# EAGLE design QuickPSoC3V2_LongPads_04042012 (EAGLE 6.2)
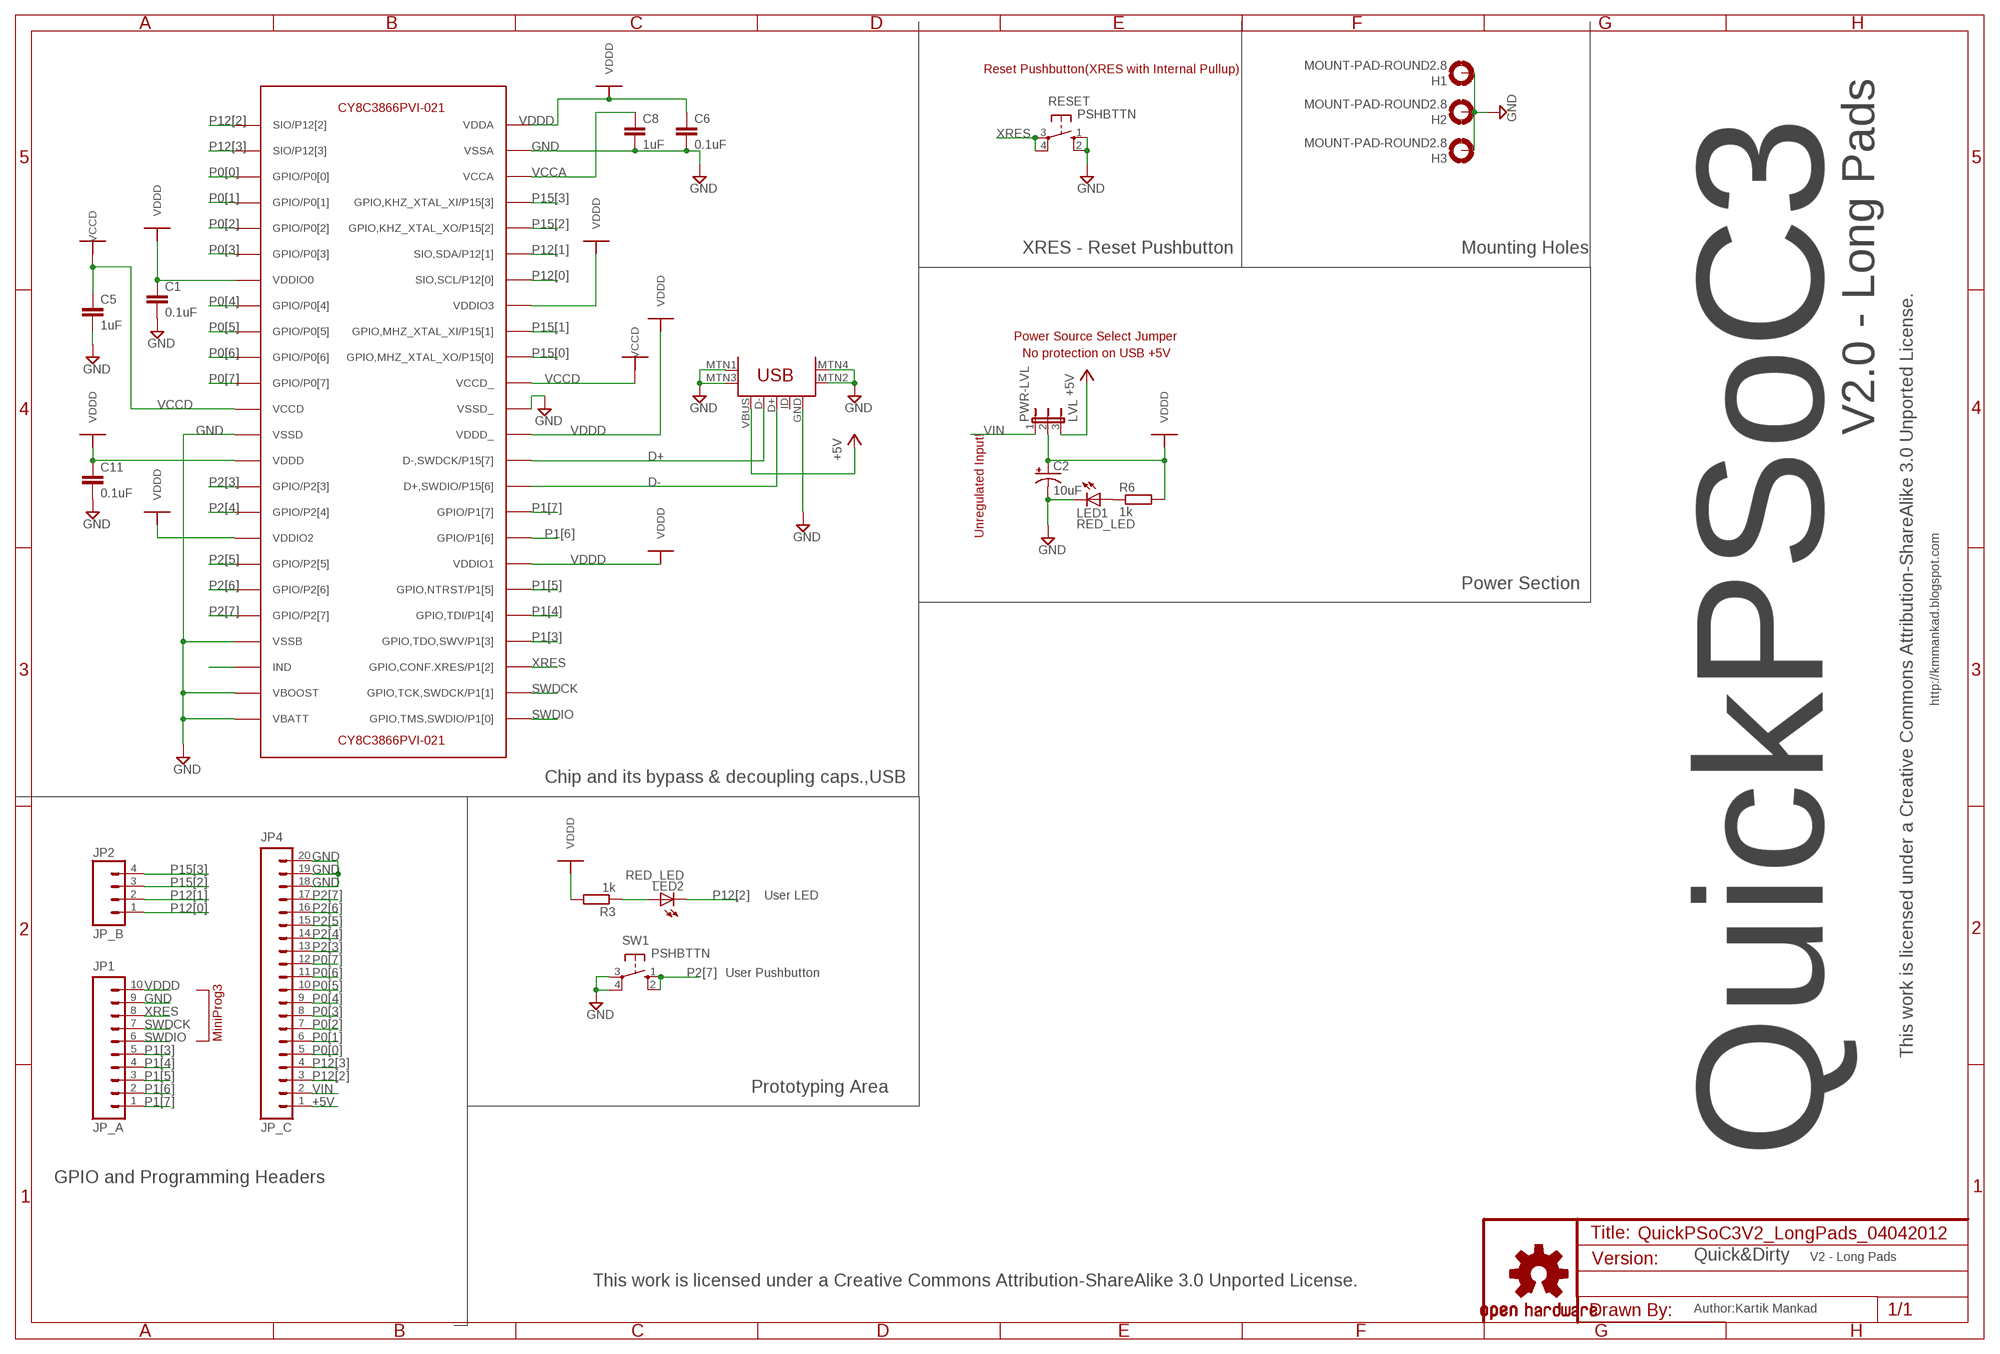
[diagram p0: schematic, sheet 1]

## Parts
C1  0.1uF  C-EUC0805K  [C0805K]
C2  10uF  CAP_POLPTH2  [CPOL-RADIAL-10UF-25V]
C5  1uF  C-EUC0805K  [C0805K]
C6  0.1uF  C-EUC0805K  [C0805K]
C8  1uF  C-EUC0805K  [C0805K]
C11  0.1uF  C-EUC0805K  [C0805K]
H1  MOUNT-PAD-ROUND2.8  [2,8-PAD]
H2  MOUNT-PAD-ROUND2.8  [2,8-PAD]
H3  MOUNT-PAD-ROUND2.8  [2,8-PAD]
JP1  JP_A  M10"  [1X10]
JP2  JP_B  M04PTH  [1X04]
JP4  JP_C  M20  [1X20]
LED1  RED_LED  LED1206  [LED-1206]
LED2  RED_LED  LED1206  [LED-1206]
PWR-LVL  LVL  JP2E  [JP2]
R3  1k  R-EU_M0805  [M0805]
R6  1k  R-EU_M0805  [M0805]
RESET  PSHBTTN  10-XX  [B3F-10XX]
SW1  PSHBTTN  10-XX  [B3F-10XX]
U$1  CY8C3866PVI-021  [SSOP48DL]
U$2  OSHW-LOGOL  [OSHW-LOGO-L]
X1  USB-MINIB-5PIN  [USB-MINIB]

## Nets
+5V: JP4.1 PWR-LVL.3 X1.VBUS
D+: U$1.35(D-,SWDCK/P15[7]) X1.D-
D-: U$1.34(D+,SWDIO/P15[6]) X1.D+
GND: C1.2 C2.2(-) C5.2 C6.2 C8.2 C11.2 H1.B2,8(MOUNT) H2.B2,8(MOUNT) H3.B2,8(MOUNT) JP1.9 JP4.18 JP4.19 JP4.20 LED1.C RESET.1(S) RESET.2(S1) SW1.3(P) SW1.4(P1) U$1.13(VSSD) U$1.21(VSSB) U$1.23(VBOOST) U$1.24(VBATT) U$1.37(VSSD_) U$1.47(VSSA) X1.GND X1.MTN1(MTN2) X1.MTN2(MTN3) X1.MTN3(MTN1) X1.MTN4
N$1: LED1.A R6.1
N$2: LED2.A R3.1
N$22: U$1.22(IND)
P0[0]: JP4.5 U$1.3(GPIO/P0[0])
P0[1]: JP4.6 U$1.4(GPIO/P0[1])
P0[2]: JP4.7 U$1.5(GPIO/P0[2])
P0[3]: JP4.8 U$1.6(GPIO/P0[3])
P0[4]: JP4.9 U$1.8(GPIO/P0[4])
P0[5]: JP4.10 U$1.9(GPIO/P0[5])
P0[6]: JP4.11 U$1.10(GPIO/P0[6])
P0[7]: JP4.12 U$1.11(GPIO/P0[7])
P1[3]: JP1.5 U$1.28(GPIO,TDO,SWV/P1[3])
P1[4]: JP1.4 U$1.29(GPIO,TDI/P1[4])
P1[5]: JP1.3 U$1.30(GPIO,NTRST/P1[5])
P1[6]: JP1.2 U$1.32(GPIO/P1[6])
P1[7]: JP1.1 U$1.33(GPIO/P1[7])
P2[3]: JP4.13 U$1.15(GPIO/P2[3])
P2[4]: JP4.14 U$1.16(GPIO/P2[4])
P2[5]: JP4.15 U$1.18(GPIO/P2[5])
P2[6]: JP4.16 U$1.19(GPIO/P2[6])
P2[7]: JP4.17 SW1.1(S) SW1.2(S1) U$1.20(GPIO/P2[7])
P12[0]: JP2.1 U$1.42(SIO,SCL/P12[0])
P12[1]: JP2.2 U$1.43(SIO,SDA/P12[1])
P12[2]: JP4.3 LED2.C U$1.1(SIO/P12[2])
P12[3]: JP4.4 U$1.2(SIO/P12[3])
P15[0]: U$1.39(GPIO,MHZ_XTAL_XO/P15[0])
P15[1]: U$1.40(GPIO,MHZ_XTAL_XI/P15[1])
P15[2]: JP2.3 U$1.44(GPIO,KHZ_XTAL_XO/P15[2])
P15[3]: JP2.4 U$1.45(GPIO,KHZ_XTAL_XI/P15[3])
SWDCK: JP1.7 U$1.26(GPIO,TCK,SWDCK/P1[1])
SWDIO: JP1.6 U$1.25(GPIO,TMS,SWDIO/P1[0])
VCCA: C8.1 U$1.46(VCCA)
VCCD: C5.1 U$1.12(VCCD) U$1.38(VCCD_)
VDDD: C1.1 C2.1(+) C6.1 C11.1 JP1.10 PWR-LVL.2 R3.2 R6.2 U$1.7(VDDIO0) U$1.14(VDDD) U$1.17(VDDIO2) U$1.31(VDDIO1) U$1.36(VDDD_) U$1.41(VDDIO3) U$1.48(VDDA)
VIN: JP4.2 PWR-LVL.1
XRES: JP1.8 RESET.3(P) RESET.4(P1) U$1.27(GPIO,CONF.XRES/P1[2])
Unconnected: X1.ID

## Notes on the sheet
- Reset Pushbutton(XRES with Internal Pullup)
- XRES - Reset Pushbutton | Mounting Holes
- This work is licensed under a Creative Commons Attribution-ShareAlike 3.0 Unported License.
- Power Source Select Jumper
- No protection on USB +5V
- V2.0 - Long Pads
- Unregulated Input!
- Power Section
- http://kmmankad.blogspot.com
- Chip and its bypass & decoupling caps.,USB
- User LED
- User Pushbutton
- MiniProg3
- Prototyping Area
- QuickPSoC3
- GPIO and Programming Headers
- Quick&Dirty | V2 - Long Pads
- This work is licensed under a Creative Commons Attribution-ShareAlike 3.0 Unported License.
- Author:Kartik Mankad

## Library data of the parts
C1 C5 C6 C8 C11 = rcl:C-EU: CAPACITOR, European symbol
C2 = SparkFun:CAP_POL: Capacitor Polarized These are standard SMD and PTH capacitors. Normally 10uF, 47uF, and 100uF in electrolytic and tantalum varieties. Always verify the external diameter of the through hole cap, it varies with capacity, voltage, and manufacturer. The EIA devices should be standard.
H1-H3 = holes:MOUNT-PAD-ROUND: MOUNTING PAD, round
JP1 = SparkFun:M10: Header 10 Standard 10-pin 0.1" header. Use with straight break away headers (SKU : PRT-00116), right angle break away headers (PRT-00553), swiss pins (PRT-00743), machine pins (PRT-00117), and female headers (PRT-00115).
JP2 = SparkFun:M04: Header 4 Standard 4-pin 0.1" header. Use with straight break away headers (SKU : PRT-00116), right angle break away headers (PRT-00553), swiss pins (PRT-00743), machine pins (PRT-00117), and female headers (PRT-00115). Molex polarized connector foot print use with SKU : PRT-08231 with associated crimp pins and housings. 1MM SMD Version SKU: PRT-10208
JP4 = SparkFun:M20: This is just like the LOCK variant in that the holes are staggared by 5 mil, but except for the last two holes. They are not altered from the "standard" footprint layout. This is used for a special purpose on the layout of our Graphic LCD Backpack. Make sure you want to use this device before selecting it for you project!
LED1 LED2 = SparkFun:LED: LEDs Standard schematic elements and footprints for 5mm, 3mm, 1206, and 0603 sized LEDs. 5mm - Spark Fun Electronics SKU : COM-00529 (and others)
PWR-LVL = jumper:JP2E: JUMPER
R3 R6 = rcl:R-EU_: RESISTOR, European symbol
RESET SW1 = switch-omron:10-XX: OMRON SWITCH
U$1 = cypress_withsoc3:CY8C3866PVI-021: Cypress PSoC® 3 CY8C3666PVI-021 Introducing the CY8C38 family of ultra low-power, flash Programmable System-on-Chip (PSoC®) devices, part of a scalable 8-bit PSoC 3 and 32-bit PSoC 5 platform. The CY8C38 family provides configurable blocks of analog, digital, and interconnect circuitry around a CPU subsystem. The combination of a CPU with a flexible analog subsystem, digital subsystem, routing, and I/O enables a high level of integration in a wide variety of consumer, industrial, and medical applications. Custom Part,added by Kartik Mankad 21-Sept '11 This work is licensed under a Creative Commons Attribution-ShareAlike 3.0 Unported License.
U$2 = SparkFun:OSHW-LOGO: Open Source Hardware Logo This logo indicates the piece of hardware it is found on incorporates a OSHW license and/or adheres to the definition of open source hardware found here: http://freedomdefined.org/OSHW
X1 = SparkFun:USB-MINIB: Mini-USB "B" connector with 5th pin broken out. Created new symbol breaking out 5th "ID" pin in mini/micro USB connector spec. See: http://en.wikipedia.org/wiki/Mini_usb#Cables. Uses same footprint as 4-pin symbol. Also added pins to connect to mounting / shield pads if required (probably not generally needed as signals aren't shielded once they leave the connector).

## Board
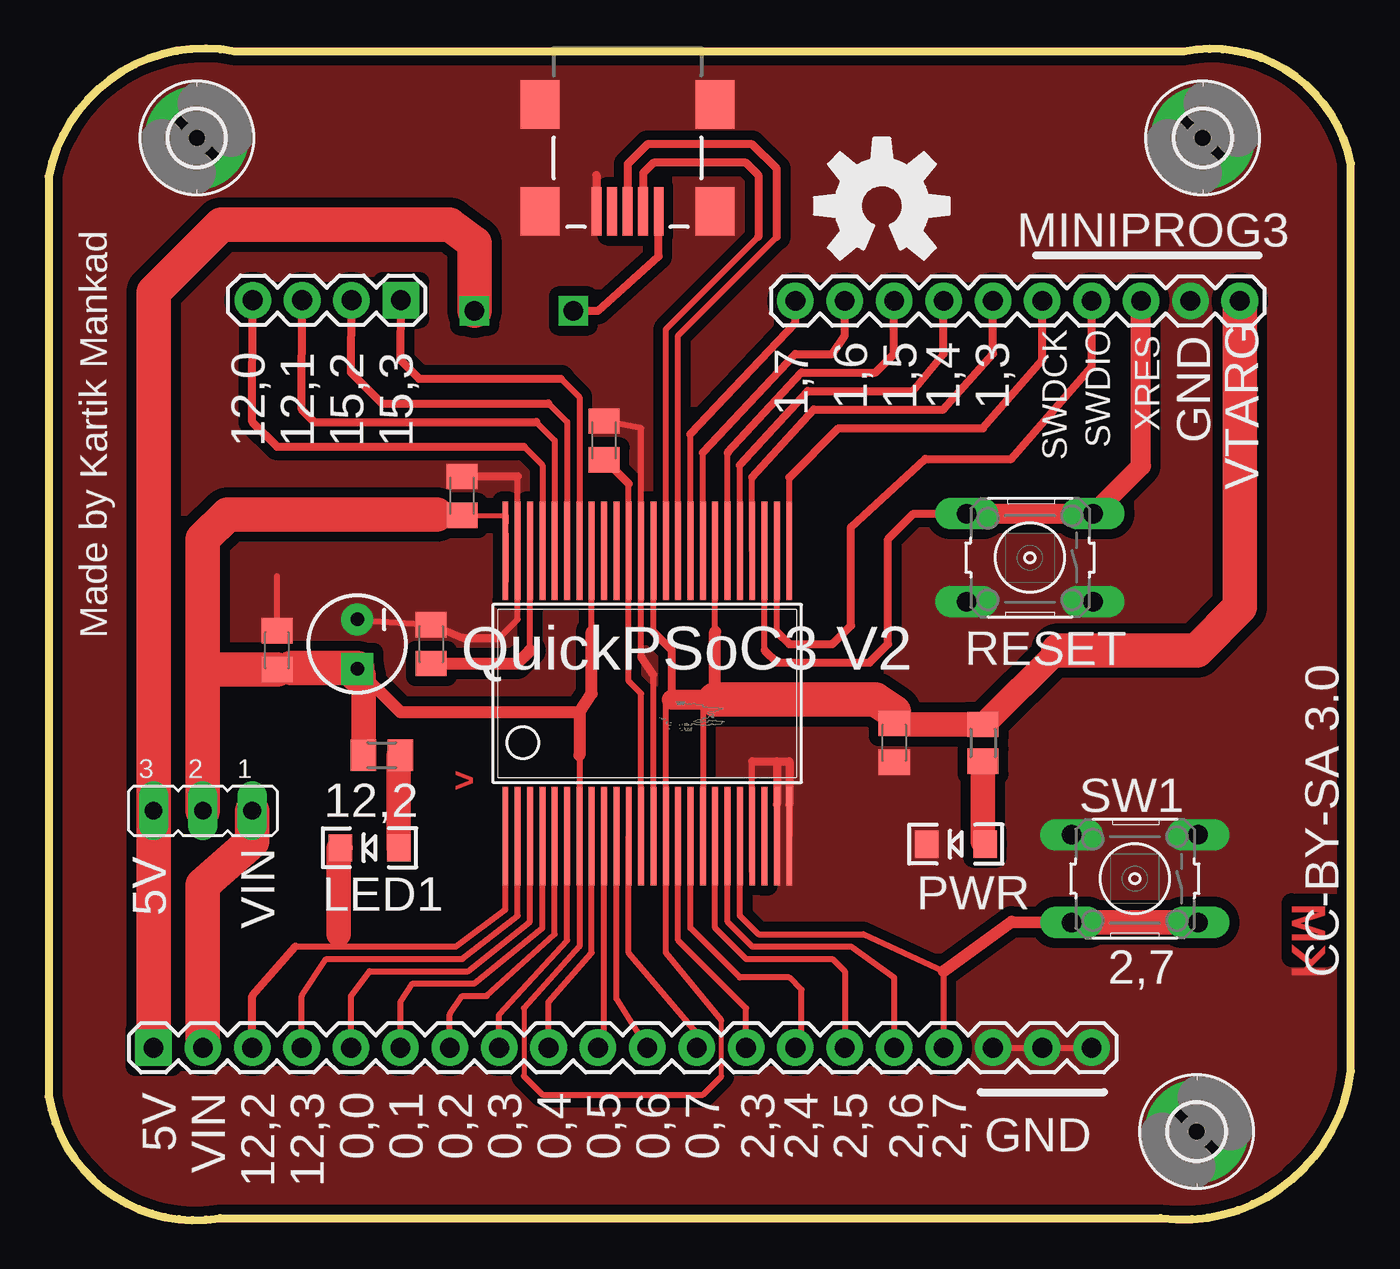
[diagram p1: board, top side]
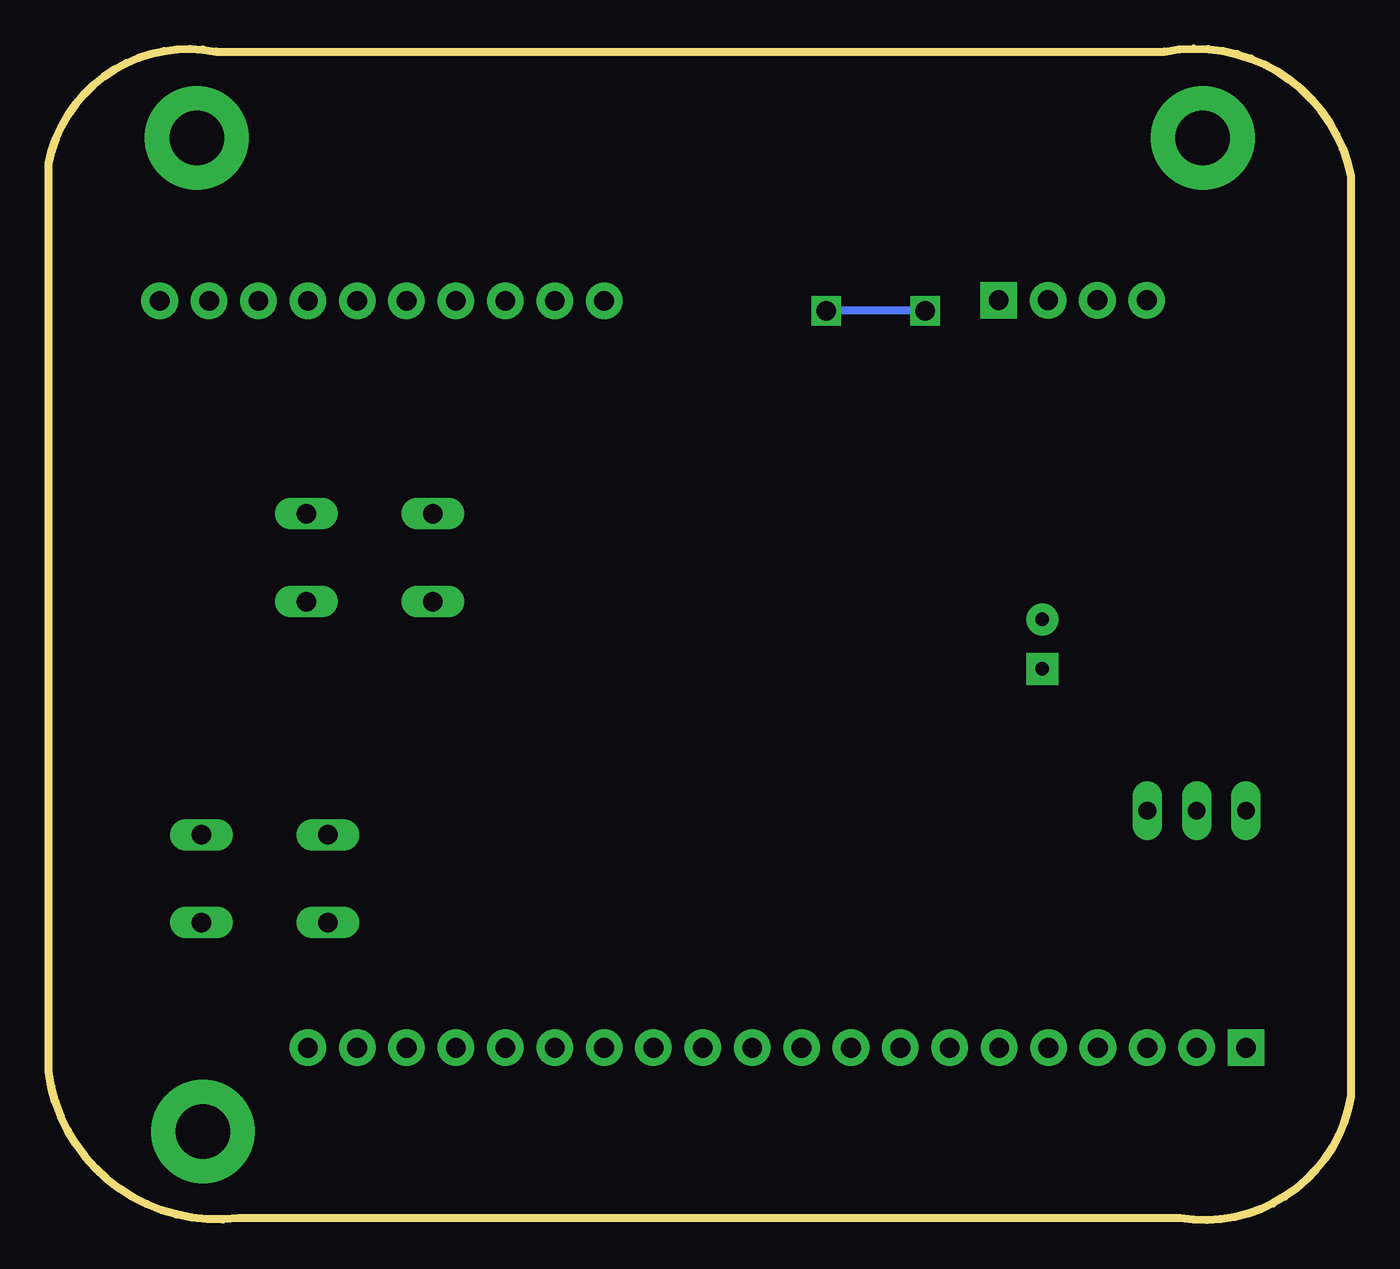
[diagram p2: board, bottom side, seen from below]

Size 66.99 x 60.27 mm. Coordinates in mm from the lower left corner, seen from the top.
Outline: 9.59,60.11 arc90 0,53.7 0,6.37 arc90 8.8,0.11 57.21,0.11 arc90 66.99,7.66 66.99,54.36 arc90 58.38,60.11 9.59,60.11
Copper layers (1*16): Top 0.035mm / dielectric 1.5mm / Bottom 0.035mm
Design rules: minimum track width 8mil, minimum drill 20mil, track to track 8mil, track to pad 8mil, pad to pad 8mil, via to via 8mil, smd to smd 8mil, copper to edge 10mil, drill to drill 8mil, minimum pad ring 12mil, minimum via ring 10mil, stop-mask expansion 4mil, vias tented up to drill 25mil, thermal gap 10mil

### Footprints (pad centres in the part's own frame; a part is rotated, then mirrored left to right if it is on the bottom)
C0805K = smd 1.3 x 1.6: 1 -1,0; 2 1,0
CPOL-RADIAL-10UF-25V = drill 0.7 pad 1.651 square: 1 1.27,0 | drill 0.7 pad 1.651: 2 -1.27,0
2,8-PAD = drill 2.8 pad 5.334: B2,8 0,0
1X10 = drill 1.016 pad 1.88: 1 0,0; 2 2.54,0; 3 5.08,0; 4 7.62,0; 5 10.16,0; 6 12.7,0; 7 15.24,0; 8 17.78,0; 9 20.32,0; 10 22.86,0
1X04 = drill 1.016 pad 1.88 square: 1 0,0 | drill 1.016 pad 1.88: 2 2.54,0; 3 5.08,0; 4 7.62,0
1X20 = drill 1.016 pad 1.88 square: 1 0,0 | drill 1.016 pad 1.88: 2 2.54,0; 3 5.08,0; 4 7.62,0; 5 10.16,0; 6 12.7,0; 7 15.24,0; 8 17.78,0; 9 20.32,0; 10 22.86,0; 11 25.4,0; 12 27.94,0; 13 30.48,0; 14 33.02,0; 15 35.56,0; 16 38.1,0; 17 40.64,0; 18 43.18,0; 19 45.72,0; 20 48.26,0
LED-1206 = smd 1.2 x 1.4: A -1.5,0; C 1.5,0
JP2 = drill 0.914 long: 1 -2.54,0; 2 0,0; 3 2.54,0
M0805 = smd 1.3 x 1.6: 1 -0.95,0; 2 0.95,0
B3F-10XX = drill 1.016 long: 1 -3.251,2.261; 2 3.251,2.261; 3 -3.251,-2.261; 4 3.251,-2.261
SSOP48DL = smd 0.305 x 5.08: 1 -7.303,-8.928; 2 -6.668,-8.928; 3 -6.032,-8.928; 4 -5.397,-8.928; 5 -4.763,-8.928; 6 -4.128,-8.928; 7 -3.493,-8.928; 8 -2.857,-8.928; 9 -2.223,-8.928; 10 -1.587,-8.928; 11 -0.953,-8.928; 12 -0.318,-8.928; 13 0.318,-8.928; 14 0.953,-8.928; 15 1.587,-8.928; 16 2.223,-8.928; 17 2.857,-8.928; 18 3.493,-8.928; 19 4.128,-8.928; 20 4.763,-8.928; 21 5.397,-8.928; 22 6.032,-8.928; 23 6.668,-8.928; 24 7.303,-8.928; 25 7.303,5.753; 26 6.668,5.753; 27 6.032,5.753; 28 5.397,5.753; 29 4.763,5.753; 30 4.128,5.753; 31 3.493,5.753; 32 2.857,5.753; 33 2.223,5.753; 34 1.587,5.753; 35 0.953,5.753; 36 0.318,5.753; 37 -0.318,5.753; 38 -0.953,5.753; 39 -1.587,5.753; 40 -2.223,5.753; 41 -2.857,5.753; 42 -3.493,5.753; 43 -4.128,5.753; 44 -4.763,5.753; 45 -5.397,5.753; 46 -6.032,5.753; 47 -6.668,5.753; 48 -7.303,5.753
USB-MINIB = smd 2.5 x 0.5: D+ 2.5,0; D- 2.5,0.8; GND 2.5,-1.6; ID 2.5,-0.8; VBUS 2.5,1.6 | smd 2.5 x 2: MTN1 -3,4.5; MTN2 2.5,4.5; MTN3 -3,-4.5; MTN4 2.5,-4.5

### Placement (x,y rotation side)
C1  11.75,29.32 90 top
C2  15.88,29.63 270 top
C5  28.58,40.11 90 top
C6  43.5,24.55 270 top
C8  19.68,29.63 90 top
C11  21.27,37.25 90 top
H1  7.62,55.67 0 top
H2  59.05,4.55 0 top
H3  59.37,55.67 0 top
JP1  38.42,47.29 0 top
JP2  18.12,47.32 180 top
JP4  5.4,8.87 0 top
LED1  46.67,19.35 180 top
LED2  16.51,19.16 180 top
PWR-LVL  7.94,21.06 180 top
R3  17.14,23.92 180 top
R6  48.07,24.55 90 top
RESET  50.48,34.08 180 top
SW1  55.88,17.57 180 top
U$1  30.8,28.68 0 top
U$2  42.86,52.18 0 top
U$3  [LOGO]  30.8,25.51 0 top
X1  29.78,54.4 270 top

### Tracks (layer width: path | path; a pad name or v marks a point on that pad's centre or on a via)
+5V  (via drill 1 pad 1.02)
  Top 0.406: X1.VBUS 31.38,49.58 28.26,46.78 v26.99,46.78
  Top 1.778: JP4.1 PWR-LVL.3 5.4,47.73 8.89,51.22 20.64,51.22 21.91,50.27 v21.91,46.78
  Bottom 0.406: v21.91,46.78 v26.99,46.78
D+
  Top 0.305: U$1.35 31.75,45.83 36.51,50.59
  Top 0.406: X1.D- 30.58,53.86 31.12,54.4 35.88,54.4 36.51,53.76 36.51,50.59
D-
  Top 0.305: U$1.34 32.39,45.51 37.46,50.59
  Top 0.406: X1.D+ 29.78,54.33 30.8,55.35 36.2,55.35 37.46,54.08 37.46,50.59
GND
  Top 0.305: JP4.18 JP4.19 JP4.20 | C2.2 16.19,30.85 C8.2 | C1.2 11.75,33.13 | C5.2 30.48,40.75 U$1.37 30.48,29 | 38.1,21.38 U$1.24 | 37.46,21.38 U$1.23 | 24.13,38.25 U$1.47 24.13,30.9 23.18,29.95 | U$1.13 31.12,28.05 | 36.2,23.6 U$1.21 36.2,17.89
  Top 0.406: 28.18,53.76 X1.GND | 38.1,21.38 38.1,23.6 37.46,23.6 | 37.46,23.6 37.46,21.38 | 36.2,23.6 37.46,23.6 | 24.13,38.25 C11.2 | 23.18,29.95 21.32,29.95 C8.2 | 31.12,28.05 30.48,29
  pour Top (isolate 0.508, no thermals): 0.32,7.57 arc90 8.1,0.11 60.16,0.11 arc90 66.99,7.57 66.99,53.18 arc90 58.47,60.11 9.54,60.07 arc90 0.32,52.79
N$1
  Top 1.27: R6.1 48.07,19.45 LED1.A
N$2
  Top 1.016: LED2.A 18.09,19.07
  Top 1.27: R3.1 18.01,23.92 LED2.A
P0[0]
  Top 0.305: JP4.5 15.56,11.54 16.51,12.81 21.59,12.81 24.76,15.35 U$1.3
P0[1]
  Top 0.305: JP4.6 18.1,11.22 18.73,12.17 21.91,12.17 25.4,15.03 U$1.4
P0[2]
  Top 0.305: JP4.7 20.64,10.58 21.27,11.54 22.54,11.54 26.03,14.71 U$1.5
P0[3]
  Top 0.305: JP4.8 23.18,10.58 26.67,14.39 U$1.6
P0[4]
  Top 0.305: U$1.8 27.94,13.76 25.72,11.22 JP4.9
P0[5]
  Top 0.305: U$1.9 28.58,9.5 JP4.10
P0[6]
  Top 0.305: U$1.10 29.21,11.41 JP4.11
P0[7]
  Top 0.305: U$1.11 29.85,13.76 33.34,9.63 JP4.12
P1[3]
  Top 0.305: U$1.28 36.2,38.21
  Top 0.406: 36.2,38.21 39.37,41.7 46.04,41.7 48.58,44.56 JP1.5
P1[4]
  Top 0.305: U$1.29 35.56,38.84
  Top 0.406: JP1.4 46.04,44.56 44.45,42.65 39.05,42.65 35.56,38.84
P1[5]
  Top 0.305: U$1.30 34.92,39.48
  Top 0.406: JP1.3 43.5,44.56 42.54,43.6 38.74,43.6 34.92,39.48
P1[6]
  Top 0.305: U$1.32 33.65,39.48
  Top 0.406: JP1.2 40.96,45.51 40.32,44.56 38.42,44.56 33.65,39.48
P1[7]
  Top 0.305: U$1.33 33.02,40.43
  Top 0.406: JP1.1 38.42,46.14 33.02,40.43
P2[3]
  Top 0.305: U$1.15 32.39,14.39 35.88,10.9 JP4.13
P2[4]
  Top 0.305: U$1.16 33.02,15.03 35.56,12.49 38.1,12.49 38.74,11.85 38.74,9.5 JP4.14
P2[5]
  Top 0.305: U$1.18 34.29,15.03 35.88,13.44 40.32,13.44 40.96,12.81 JP4.15
P2[6]
  Top 0.305: U$1.19 34.92,15.35 36.2,14.08 41.28,14.08 43.5,12.49 JP4.16
P2[7]
  Top 0.305: U$1.20 35.56,15.66 36.51,14.71 41.91,14.71 46.04,12.81 JP4.17
  Top 0.406: 56.2,15.31 56.2,15.38
  Top 0.61: 46.04,12.81 49.53,15.35 53.34,15.31
  Top 1.27: SW1.2 53.34,15.31 56.2,15.31 SW1.1
P12[0]
  Top 0.305: U$1.42 27.3,42.33 26.35,43.29
  Top 0.406: 26.35,43.29 19.05,43.29 18.1,44.24 JP2.1
P12[1]
  Top 0.305: 25.72,42.02 26.67,41.06 U$1.43
  Top 0.406: JP2.2 15.56,43.6 17.15,42.02 25.72,42.02
P12[2]
  Top 0.254: 14.92,14.08 14.92,14.71
  Top 0.305: U$1.1 23.49,15.98 20.96,14.08 14.92,14.08 12.7,14.08 | JP4.3 10.48,9.63
  Top 0.406: 10.48,9.63 10.48,11.54 12.7,14.08
  Top 1.27: 14.92,14.71 14.92,19.16 LED2.C
P12[3]
  Top 0.305: U$1.2 24.13,15.66 21.27,13.44 14.29,13.44 13.02,11.54 JP4.4
P15[2]
  Top 0.305: U$1.44 26.03,40.11 25.08,41.06
  Top 0.406: JP2.3 13.02,41.7 13.65,41.06 25.08,41.06
P15[3]
  Top 0.305: U$1.45 25.4,38.84 24.45,39.79
  Top 0.406: JP2.4 10.48,41.06 11.75,39.79 24.45,39.79
SWDCK
  Top 0.305: 37.46,30.27 U$1.26
  Top 0.406: JP1.7 53.66,43.92 49.53,39.16 45.09,39.16 41.28,35.67 41.28,30.59 40.32,29.63 38.1,29.63 37.46,30.27
SWDIO
  Top 0.305: U$1.25 38.1,38.21
  Top 0.406: 38.1,38.21 40.64,40.75 48.07,40.75 51.12,44.24 JP1.6
VCCA
  Top 0.305: 24.76,29.32 U$1.46
  Top 0.61: C8.1 24.08,28.63 24.76,29.32
VCCD
  Top 0.305: U$1.12 30.48,27.09 29.85,27.73 U$1.38 29.85,37.89 | 28.84,38.89 C5.1
  Top 0.406: 29.85,37.89 28.84,38.89
VDDD
  Top 0.254: 24.45,10.9 24.45,7.41 | 34.61,7.41 34.61,10.27 | C11.1 23.54,36.25 23.49,35.35 | 43.5,26.14 43.18,25.87 C6.1
  Top 0.305: 34.29,30.27 U$1.31 | 31.75,26.78 U$1.14 31.75,13.76 34.61,10.27 | 33.65,26.78 U$1.17 | 31.12,34.71 U$1.36 31.12,30.27 | 24.45,10.9 27.3,14.08 U$1.7 27.3,23.92 | 24.45,7.41 25.4,6.46 33.65,6.46 34.61,7.41 | 23.49,35.35 U$1.48 23.49,32.81 | 27.94,30.27 U$1.41
  Top 0.406: 31.75,26.78 32.07,26.78 32.07,29.32 31.12,30.27 | R6.2 48.12,25.51
  Top 0.61: 34.29,26.78 34.29,30.27 | 27.3,26.14 27.94,27.09 27.94,30.27 | 27.3,26.14 27.3,23.92 | 27.3,26.14 18.1,26.14 C2.1 | C2.1 15.82,28.42
  Top 1.016: 32.07,26.78 33.65,26.78 34.29,26.78 | 7.99,28.42 7.94,28.1 | 7.94,28.05 7.99,28.42 | 19.95,36.3 C11.1 | C6.1 44.18,25.5 | C1.1 12.48,28.42 | 7.99,28.42 8.09,28.32
  Top 1.27: 44.18,25.5 R6.2 | 48.12,25.51 51.93,29.32 | 15.88,28.04 16.2,27.73 | R3.2 16.2,28.04 C2.1 15.88,28.42
  Top 1.778: 7.94,28.1 7.94,35.03 9.21,36.3 19.95,36.3 | JP1.10 61.28,31.54 59.06,29.32 51.93,29.32 | 8.09,28.32 C1.1 | 12.48,28.42 15.88,28.42 | C2.1 15.88,28.04 | PWR-LVL.2 7.94,28.05 | 34.29,26.78 42.54,26.78 43.5,26.14
VIN
  Top 1.778: JP4.2 7.94,17.25 10.48,19.47 PWR-LVL.1
XRES
  Top 0.305: 36.83,29.32 U$1.27
  Top 0.406: RESET.4 44.49,36.34 43.18,35.03 43.18,29.63 42.23,28.68 37.46,28.68 36.83,29.32
  Top 1.016: RESET.4 RESET.3 56.2,38.8 JP1.8

### Text on the board
Top: > | KM
tNames: MINIPROG3 | Made by Kartik Mankad | SWDCK | SWDIO | XRES | GND | 1,6 | 1,5 | 1,4 | 1,3 | 1,7 | 12,0 | 12,1 | 15,2 | 15,3 | VTARG | QuickPSoC3 V2 | SW1 | 12,2 | VIN | LED1 | 5V | PWR | CC-BY-SA 3.0 | 2,7 | 5V | VIN | 12,2 | 12,3 | 0,0 | 0,1 | 0,2 | 0,3 | 0,4 | 0,5 | 0,6 | 0,7 | 2,3 | 2,4 | 2,5 | 2,6 | 2,7 | GND
Document: QuickPSoC3 V2 - Long Pads - Designed by Kartik Mankad | This work is licensed under a Creative Commons Attribution-ShareAlike 3.0 Unported License.